# EAGLE schematic Lafferty1ab (EAGLE 6.6.0), part 2 of 2
## Sheet 5 of 5
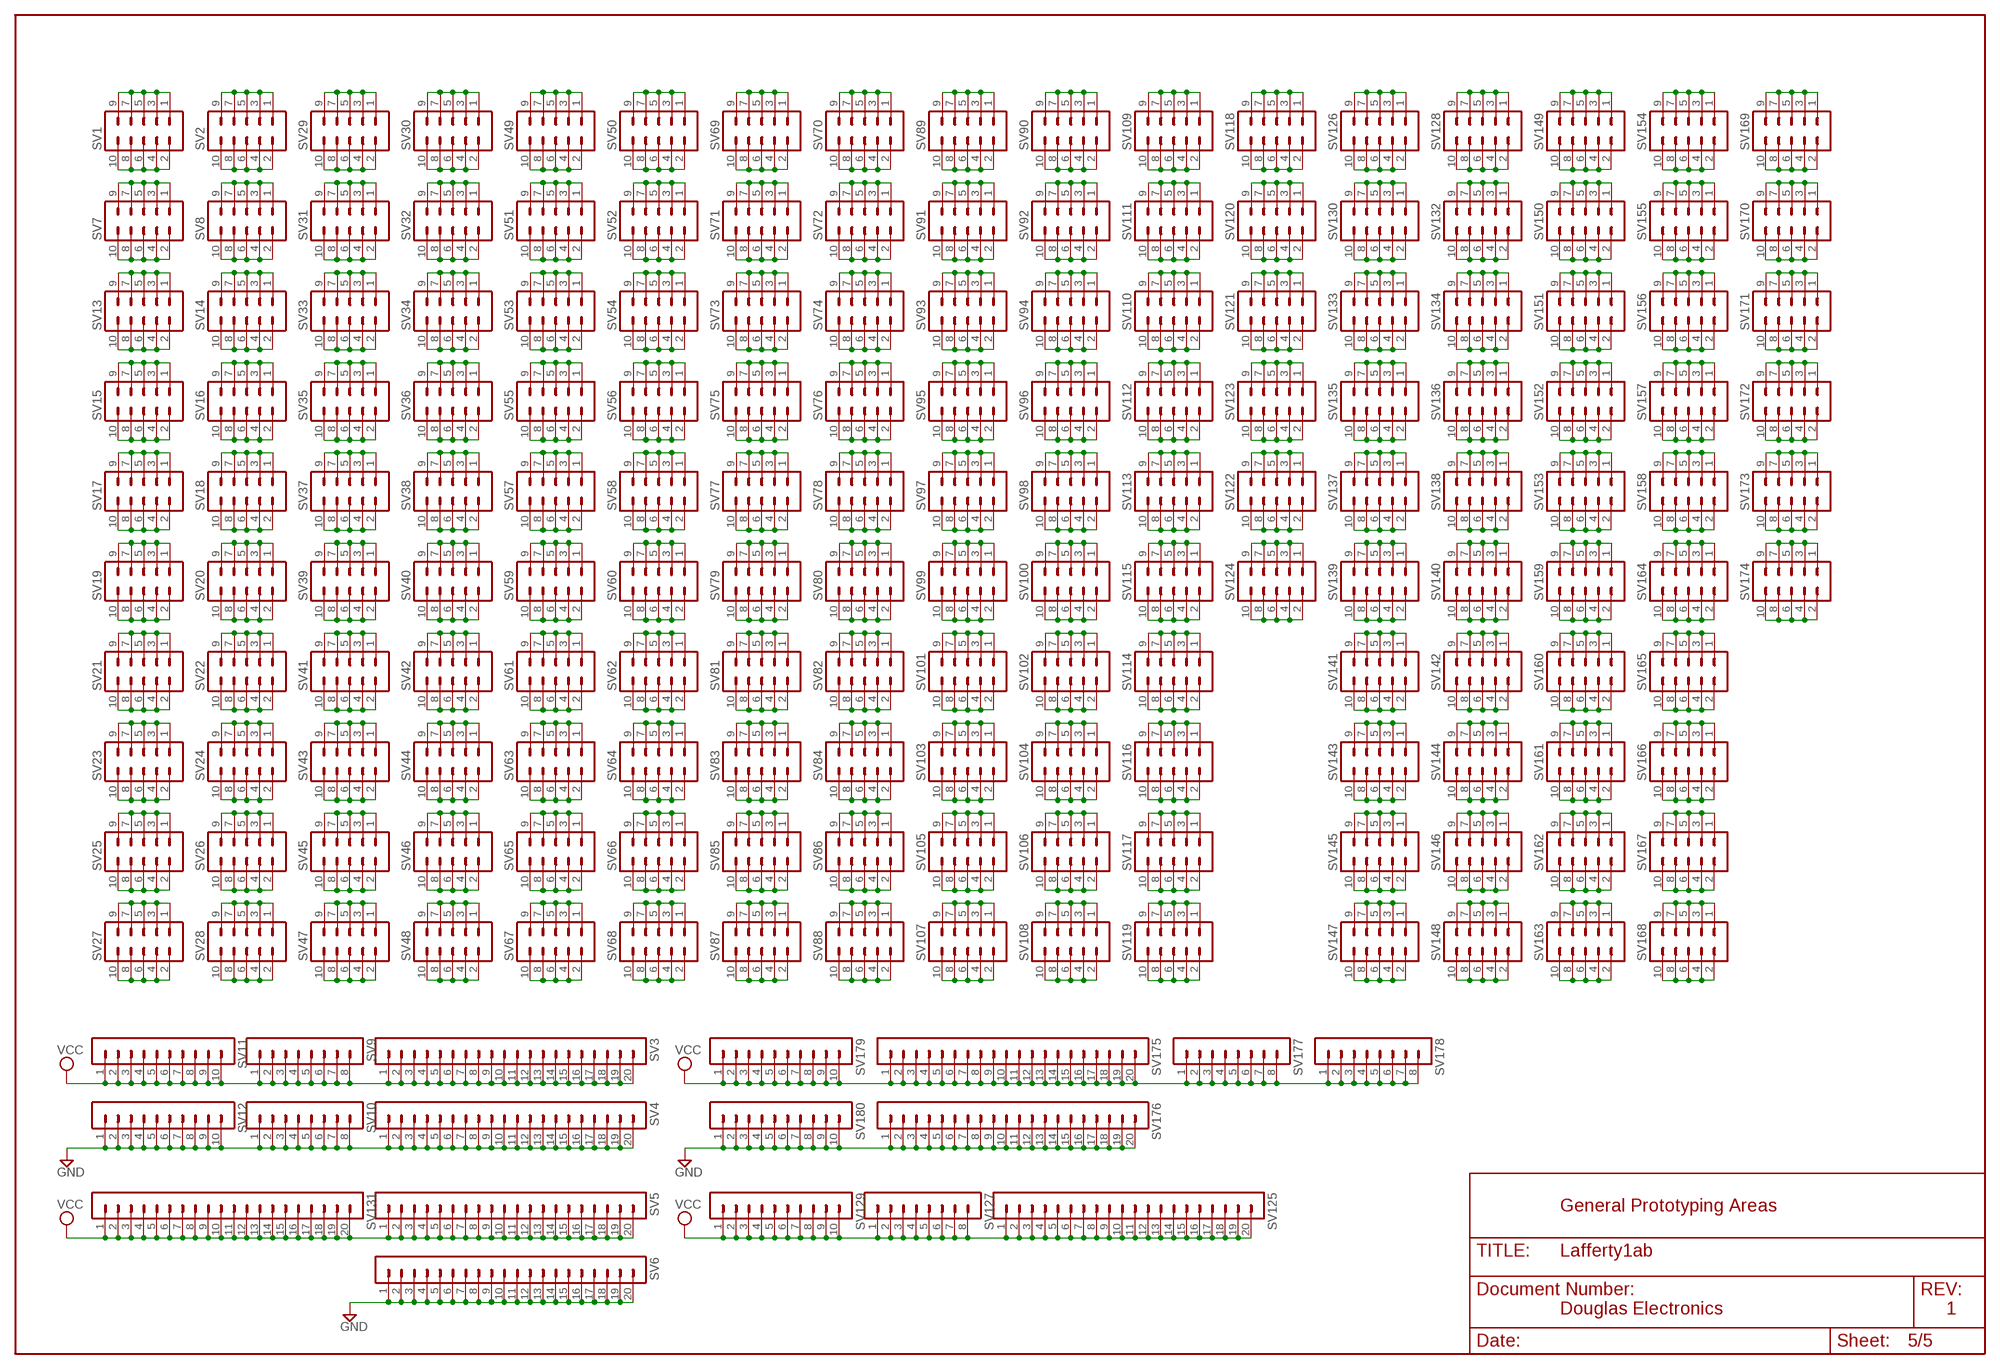
[diagram p4: schematic, sheet 5]

### Parts
SV1  MA05-2  [MA05-2]
SV2  MA05-2  [MA05-2]
SV3  MA20-1  [MA20-1]
SV4  MA20-1  [MA20-1]
SV5  MA20-1  [MA20-1]
SV6  MA20-1  [MA20-1]
SV7  MA05-2  [MA05-2]
SV8  MA05-2  [MA05-2]
SV9  MA08-1  [MA08-1]
SV10  MA08-1  [MA08-1]
SV11  MA10-1  [MA10-1]
SV12  MA10-1  [MA10-1]
SV13  MA05-2  [MA05-2]
SV14  MA05-2  [MA05-2]
SV15  MA05-2  [MA05-2]
SV16  MA05-2  [MA05-2]
SV17  MA05-2  [MA05-2]
SV18  MA05-2  [MA05-2]
SV19  MA05-2  [MA05-2]
SV20  MA05-2  [MA05-2]
SV21  MA05-2  [MA05-2]
SV22  MA05-2  [MA05-2]
SV23  MA05-2  [MA05-2]
SV24  MA05-2  [MA05-2]
SV25  MA05-2  [MA05-2]
SV26  MA05-2  [MA05-2]
SV27  MA05-2  [MA05-2]
SV28  MA05-2  [MA05-2]
SV29  MA05-2  [MA05-2]
SV30  MA05-2  [MA05-2]
SV31  MA05-2  [MA05-2]
SV32  MA05-2  [MA05-2]
SV33  MA05-2  [MA05-2]
SV34  MA05-2  [MA05-2]
SV35  MA05-2  [MA05-2]
SV36  MA05-2  [MA05-2]
SV37  MA05-2  [MA05-2]
SV38  MA05-2  [MA05-2]
SV39  MA05-2  [MA05-2]
SV40  MA05-2  [MA05-2]
SV41  MA05-2  [MA05-2]
SV42  MA05-2  [MA05-2]
SV43  MA05-2  [MA05-2]
SV44  MA05-2  [MA05-2]
SV45  MA05-2  [MA05-2]
SV46  MA05-2  [MA05-2]
SV47  MA05-2  [MA05-2]
SV48  MA05-2  [MA05-2]
SV49  MA05-2  [MA05-2]
SV50  MA05-2  [MA05-2]
SV51  MA05-2  [MA05-2]
SV52  MA05-2  [MA05-2]
SV53  MA05-2  [MA05-2]
SV54  MA05-2  [MA05-2]
SV55  MA05-2  [MA05-2]
SV56  MA05-2  [MA05-2]
SV57  MA05-2  [MA05-2]
SV58  MA05-2  [MA05-2]
SV59  MA05-2  [MA05-2]
SV60  MA05-2  [MA05-2]
SV61  MA05-2  [MA05-2]
SV62  MA05-2  [MA05-2]
SV63  MA05-2  [MA05-2]
SV64  MA05-2  [MA05-2]
SV65  MA05-2  [MA05-2]
SV66  MA05-2  [MA05-2]
SV67  MA05-2  [MA05-2]
SV68  MA05-2  [MA05-2]
SV69  MA05-2  [MA05-2]
SV70  MA05-2  [MA05-2]
SV71  MA05-2  [MA05-2]
SV72  MA05-2  [MA05-2]
SV73  MA05-2  [MA05-2]
SV74  MA05-2  [MA05-2]
SV75  MA05-2  [MA05-2]
SV76  MA05-2  [MA05-2]
SV77  MA05-2  [MA05-2]
SV78  MA05-2  [MA05-2]
SV79  MA05-2  [MA05-2]
SV80  MA05-2  [MA05-2]
SV81  MA05-2  [MA05-2]
SV82  MA05-2  [MA05-2]
SV83  MA05-2  [MA05-2]
SV84  MA05-2  [MA05-2]
SV85  MA05-2  [MA05-2]
SV86  MA05-2  [MA05-2]
SV87  MA05-2  [MA05-2]
SV88  MA05-2  [MA05-2]
SV89  MA05-2  [MA05-2]
SV90  MA05-2  [MA05-2]
SV91  MA05-2  [MA05-2]
SV92  MA05-2  [MA05-2]
SV93  MA05-2  [MA05-2]
SV94  MA05-2  [MA05-2]
SV95  MA05-2  [MA05-2]
SV96  MA05-2  [MA05-2]
SV97  MA05-2  [MA05-2]
SV98  MA05-2  [MA05-2]
SV99  MA05-2  [MA05-2]
SV100  MA05-2  [MA05-2]
SV101  MA05-2  [MA05-2]
SV102  MA05-2  [MA05-2]
SV103  MA05-2  [MA05-2]
SV104  MA05-2  [MA05-2]
SV105  MA05-2  [MA05-2]
SV106  MA05-2  [MA05-2]
SV107  MA05-2  [MA05-2]
SV108  MA05-2  [MA05-2]
SV109  MA05-2  [MA05-2]
SV110  MA05-2  [MA05-2]
SV111  MA05-2  [MA05-2]
SV112  MA05-2  [MA05-2]
SV113  MA05-2  [MA05-2]
SV114  MA05-2  [MA05-2]
SV115  MA05-2  [MA05-2]
SV116  MA05-2  [MA05-2]
SV117  MA05-2  [MA05-2]
SV118  MA05-2  [MA05-2]
SV119  MA05-2  [MA05-2]
SV120  MA05-2  [MA05-2]
SV121  MA05-2  [MA05-2]
SV122  MA05-2  [MA05-2]
SV123  MA05-2  [MA05-2]
SV124  MA05-2  [MA05-2]
SV125  MA20-1  [MA20-1]
SV126  MA05-2  [MA05-2]
SV127  MA08-1  [MA08-1]
SV128  MA05-2  [MA05-2]
SV129  MA10-1  [MA10-1]
SV130  MA05-2  [MA05-2]
SV131  MA20-1  [MA20-1]
SV132  MA05-2  [MA05-2]
SV133  MA05-2  [MA05-2]
SV134  MA05-2  [MA05-2]
SV135  MA05-2  [MA05-2]
SV136  MA05-2  [MA05-2]
SV137  MA05-2  [MA05-2]
SV138  MA05-2  [MA05-2]
SV139  MA05-2  [MA05-2]
SV140  MA05-2  [MA05-2]
SV141  MA05-2  [MA05-2]
SV142  MA05-2  [MA05-2]
SV143  MA05-2  [MA05-2]
SV144  MA05-2  [MA05-2]
SV145  MA05-2  [MA05-2]
SV146  MA05-2  [MA05-2]
SV147  MA05-2  [MA05-2]
SV148  MA05-2  [MA05-2]
SV149  MA05-2  [MA05-2]
SV150  MA05-2  [MA05-2]
SV151  MA05-2  [MA05-2]
SV152  MA05-2  [MA05-2]
SV153  MA05-2  [MA05-2]
SV154  MA05-2  [MA05-2]
SV155  MA05-2  [MA05-2]
SV156  MA05-2  [MA05-2]
SV157  MA05-2  [MA05-2]
SV158  MA05-2  [MA05-2]
SV159  MA05-2  [MA05-2]
SV160  MA05-2  [MA05-2]
SV161  MA05-2  [MA05-2]
SV162  MA05-2  [MA05-2]
SV163  MA05-2  [MA05-2]
SV164  MA05-2  [MA05-2]
SV165  MA05-2  [MA05-2]
SV166  MA05-2  [MA05-2]
SV167  MA05-2  [MA05-2]
SV168  MA05-2  [MA05-2]
SV169  MA05-2  [MA05-2]
SV170  MA05-2  [MA05-2]
SV171  MA05-2  [MA05-2]
SV172  MA05-2  [MA05-2]
SV173  MA05-2  [MA05-2]
SV174  MA05-2  [MA05-2]
SV175  MA20-1  [MA20-1]
SV176  MA20-1  [MA20-1]
SV177  MA08-1  [MA08-1]
SV178  MA08-1  [MA08-1]
SV179  MA10-1  [MA10-1]
SV180  MA10-1  [MA10-1]

### Nets
GND [supply]: SV4.1 SV4.2 SV4.3 SV4.4 SV4.5 SV4.6 SV4.7 SV4.8 SV4.9 SV4.10 SV4.11 SV4.12 SV4.13 SV4.14 SV4.15 SV4.16 SV4.17 SV4.18 SV4.19 SV4.20 SV6.1 SV6.2 SV6.3 SV6.4 SV6.5 SV6.6 SV6.7 SV6.8 SV6.9 SV6.10 SV6.11 SV6.12 SV6.13 SV6.14 SV6.15 SV6.16 SV6.17 SV6.18 SV6.19 SV6.20 SV10.1 SV10.2 SV10.3 SV10.4 SV10.5 SV10.6 SV10.7 SV10.8 SV12.1 SV12.2 SV12.3 SV12.4 SV12.5 SV12.6 SV12.7 SV12.8 SV12.9 SV12.10 SV176.1 SV176.2 SV176.3 SV176.4 SV176.5 SV176.6 SV176.7 SV176.8 SV176.9 SV176.10 SV176.11 SV176.12 SV176.13 SV176.14 SV176.15 SV176.16 SV176.17 SV176.18 SV176.19 SV176.20 SV180.1 SV180.2 SV180.3 SV180.4 SV180.5 SV180.6 SV180.7 SV180.8 SV180.9 SV180.10 ; also sheet 1,2,3,4
N$247: SV1.1 SV1.3 SV1.5 SV1.7 SV1.9
N$248: SV1.2 SV1.4 SV1.6 SV1.8 SV1.10
N$249: SV7.1 SV7.3 SV7.5 SV7.7 SV7.9
N$250: SV2.1 SV2.3 SV2.5 SV2.7 SV2.9
N$251: SV2.2 SV2.4 SV2.6 SV2.8 SV2.10
N$252: SV7.2 SV7.4 SV7.6 SV7.8 SV7.10
N$253: SV8.1 SV8.3 SV8.5 SV8.7 SV8.9
N$254: SV8.2 SV8.4 SV8.6 SV8.8 SV8.10
N$255: SV13.1 SV13.3 SV13.5 SV13.7 SV13.9
N$256: SV13.2 SV13.4 SV13.6 SV13.8 SV13.10
N$257: SV14.1 SV14.3 SV14.5 SV14.7 SV14.9
N$258: SV14.2 SV14.4 SV14.6 SV14.8 SV14.10
N$259: SV15.1 SV15.3 SV15.5 SV15.7 SV15.9
N$260: SV15.2 SV15.4 SV15.6 SV15.8 SV15.10
N$261: SV16.1 SV16.3 SV16.5 SV16.7 SV16.9
N$262: SV16.2 SV16.4 SV16.6 SV16.8 SV16.10
N$263: SV17.1 SV17.3 SV17.5 SV17.7 SV17.9
N$264: SV17.2 SV17.4 SV17.6 SV17.8 SV17.10
N$265: SV18.1 SV18.3 SV18.5 SV18.7 SV18.9
N$266: SV18.2 SV18.4 SV18.6 SV18.8 SV18.10
N$267: SV19.1 SV19.3 SV19.5 SV19.7 SV19.9
N$268: SV19.2 SV19.4 SV19.6 SV19.8 SV19.10
N$269: SV20.1 SV20.3 SV20.5 SV20.7 SV20.9
N$270: SV20.2 SV20.4 SV20.6 SV20.8 SV20.10
N$271: SV21.1 SV21.3 SV21.5 SV21.7 SV21.9
N$272: SV21.2 SV21.4 SV21.6 SV21.8 SV21.10
N$273: SV22.1 SV22.3 SV22.5 SV22.7 SV22.9
N$274: SV22.2 SV22.4 SV22.6 SV22.8 SV22.10
N$275: SV23.1 SV23.3 SV23.5 SV23.7 SV23.9
N$276: SV23.2 SV23.4 SV23.6 SV23.8 SV23.10
N$277: SV24.1 SV24.3 SV24.5 SV24.7 SV24.9
N$278: SV24.2 SV24.4 SV24.6 SV24.8 SV24.10
N$279: SV25.1 SV25.3 SV25.5 SV25.7 SV25.9
N$280: SV25.2 SV25.4 SV25.6 SV25.8 SV25.10
N$281: SV26.1 SV26.3 SV26.5 SV26.7 SV26.9
N$282: SV26.2 SV26.4 SV26.6 SV26.8 SV26.10
N$283: SV27.1 SV27.3 SV27.5 SV27.7 SV27.9
N$284: SV27.2 SV27.4 SV27.6 SV27.8 SV27.10
N$285: SV28.1 SV28.3 SV28.5 SV28.7 SV28.9
N$286: SV28.2 SV28.4 SV28.6 SV28.8 SV28.10
N$287: SV29.1 SV29.3 SV29.5 SV29.7 SV29.9
N$288: SV29.2 SV29.4 SV29.6 SV29.8 SV29.10
N$289: SV30.1 SV30.3 SV30.5 SV30.7 SV30.9
N$290: SV30.2 SV30.4 SV30.6 SV30.8 SV30.10
N$291: SV31.1 SV31.3 SV31.5 SV31.7 SV31.9
N$292: SV31.2 SV31.4 SV31.6 SV31.8 SV31.10
N$293: SV32.1 SV32.3 SV32.5 SV32.7 SV32.9
N$294: SV32.2 SV32.4 SV32.6 SV32.8 SV32.10
N$295: SV33.1 SV33.3 SV33.5 SV33.7 SV33.9
N$296: SV33.2 SV33.4 SV33.6 SV33.8 SV33.10
N$297: SV34.1 SV34.3 SV34.5 SV34.7 SV34.9
N$298: SV34.2 SV34.4 SV34.6 SV34.8 SV34.10
N$299: SV35.1 SV35.3 SV35.5 SV35.7 SV35.9
N$300: SV35.2 SV35.4 SV35.6 SV35.8 SV35.10
N$301: SV36.1 SV36.3 SV36.5 SV36.7 SV36.9
N$302: SV36.2 SV36.4 SV36.6 SV36.8 SV36.10
N$303: SV37.1 SV37.3 SV37.5 SV37.7 SV37.9
N$304: SV37.2 SV37.4 SV37.6 SV37.8 SV37.10
N$305: SV38.1 SV38.3 SV38.5 SV38.7 SV38.9
N$306: SV38.2 SV38.4 SV38.6 SV38.8 SV38.10
N$307: SV39.1 SV39.3 SV39.5 SV39.7 SV39.9
N$308: SV39.2 SV39.4 SV39.6 SV39.8 SV39.10
N$309: SV40.1 SV40.3 SV40.5 SV40.7 SV40.9
N$310: SV40.2 SV40.4 SV40.6 SV40.8 SV40.10
N$311: SV41.1 SV41.3 SV41.5 SV41.7 SV41.9
N$312: SV41.2 SV41.4 SV41.6 SV41.8 SV41.10
N$313: SV42.1 SV42.3 SV42.5 SV42.7 SV42.9
N$314: SV42.2 SV42.4 SV42.6 SV42.8 SV42.10
N$315: SV43.1 SV43.3 SV43.5 SV43.7 SV43.9
N$316: SV43.2 SV43.4 SV43.6 SV43.8 SV43.10
N$317: SV44.1 SV44.3 SV44.5 SV44.7 SV44.9
N$318: SV44.2 SV44.4 SV44.6 SV44.8 SV44.10
N$319: SV45.1 SV45.3 SV45.5 SV45.7 SV45.9
N$320: SV45.2 SV45.4 SV45.6 SV45.8 SV45.10
N$321: SV46.1 SV46.3 SV46.5 SV46.7 SV46.9
N$322: SV46.2 SV46.4 SV46.6 SV46.8 SV46.10
N$323: SV47.1 SV47.3 SV47.5 SV47.7 SV47.9
N$324: SV47.2 SV47.4 SV47.6 SV47.8 SV47.10
N$325: SV48.1 SV48.3 SV48.5 SV48.7 SV48.9
N$326: SV48.2 SV48.4 SV48.6 SV48.8 SV48.10
N$327: SV49.1 SV49.3 SV49.5 SV49.7 SV49.9
N$328: SV49.2 SV49.4 SV49.6 SV49.8 SV49.10
N$329: SV50.1 SV50.3 SV50.5 SV50.7 SV50.9
N$330: SV50.2 SV50.4 SV50.6 SV50.8 SV50.10
N$331: SV51.1 SV51.3 SV51.5 SV51.7 SV51.9
N$332: SV51.2 SV51.4 SV51.6 SV51.8 SV51.10
N$333: SV52.1 SV52.3 SV52.5 SV52.7 SV52.9
N$334: SV52.2 SV52.4 SV52.6 SV52.8 SV52.10
N$335: SV53.1 SV53.3 SV53.5 SV53.7 SV53.9
N$336: SV53.2 SV53.4 SV53.6 SV53.8 SV53.10
N$337: SV54.1 SV54.3 SV54.5 SV54.7 SV54.9
N$338: SV54.2 SV54.4 SV54.6 SV54.8 SV54.10
N$339: SV55.1 SV55.3 SV55.5 SV55.7 SV55.9
N$340: SV55.2 SV55.4 SV55.6 SV55.8 SV55.10
N$341: SV56.1 SV56.3 SV56.5 SV56.7 SV56.9
N$342: SV56.2 SV56.4 SV56.6 SV56.8 SV56.10
N$343: SV57.1 SV57.3 SV57.5 SV57.7 SV57.9
N$344: SV57.2 SV57.4 SV57.6 SV57.8 SV57.10
N$345: SV58.1 SV58.3 SV58.5 SV58.7 SV58.9
N$346: SV58.2 SV58.4 SV58.6 SV58.8 SV58.10
N$347: SV59.1 SV59.3 SV59.5 SV59.7 SV59.9
N$348: SV59.2 SV59.4 SV59.6 SV59.8 SV59.10
N$349: SV60.1 SV60.3 SV60.5 SV60.7 SV60.9
N$350: SV60.2 SV60.4 SV60.6 SV60.8 SV60.10
N$351: SV61.1 SV61.3 SV61.5 SV61.7 SV61.9
N$352: SV61.2 SV61.4 SV61.6 SV61.8 SV61.10
N$353: SV62.1 SV62.3 SV62.5 SV62.7 SV62.9
N$354: SV62.2 SV62.4 SV62.6 SV62.8 SV62.10
N$355: SV63.1 SV63.3 SV63.5 SV63.7 SV63.9
N$356: SV63.2 SV63.4 SV63.6 SV63.8 SV63.10
N$357: SV64.1 SV64.3 SV64.5 SV64.7 SV64.9
N$358: SV64.2 SV64.4 SV64.6 SV64.8 SV64.10
N$359: SV65.1 SV65.3 SV65.5 SV65.7 SV65.9
N$360: SV65.2 SV65.4 SV65.6 SV65.8 SV65.10
N$361: SV66.1 SV66.3 SV66.5 SV66.7 SV66.9
N$362: SV66.2 SV66.4 SV66.6 SV66.8 SV66.10
N$363: SV67.1 SV67.3 SV67.5 SV67.7 SV67.9
N$364: SV67.2 SV67.4 SV67.6 SV67.8 SV67.10
N$365: SV68.1 SV68.3 SV68.5 SV68.7 SV68.9
N$366: SV68.2 SV68.4 SV68.6 SV68.8 SV68.10
N$367: SV69.1 SV69.3 SV69.5 SV69.7 SV69.9
N$368: SV69.2 SV69.4 SV69.6 SV69.8 SV69.10
N$369: SV70.1 SV70.3 SV70.5 SV70.7 SV70.9
N$370: SV70.2 SV70.4 SV70.6 SV70.8 SV70.10
N$371: SV71.1 SV71.3 SV71.5 SV71.7 SV71.9
N$372: SV71.2 SV71.4 SV71.6 SV71.8 SV71.10
N$373: SV72.1 SV72.3 SV72.5 SV72.7 SV72.9
N$374: SV72.2 SV72.4 SV72.6 SV72.8 SV72.10
N$375: SV73.1 SV73.3 SV73.5 SV73.7 SV73.9
N$376: SV73.2 SV73.4 SV73.6 SV73.8 SV73.10
N$377: SV74.1 SV74.3 SV74.5 SV74.7 SV74.9
N$378: SV74.2 SV74.4 SV74.6 SV74.8 SV74.10
N$379: SV75.1 SV75.3 SV75.5 SV75.7 SV75.9
N$380: SV75.2 SV75.4 SV75.6 SV75.8 SV75.10
N$381: SV76.1 SV76.3 SV76.5 SV76.7 SV76.9
N$382: SV76.2 SV76.4 SV76.6 SV76.8 SV76.10
N$383: SV77.1 SV77.3 SV77.5 SV77.7 SV77.9
N$384: SV77.2 SV77.4 SV77.6 SV77.8 SV77.10
N$385: SV78.1 SV78.3 SV78.5 SV78.7 SV78.9
N$386: SV78.2 SV78.4 SV78.6 SV78.8 SV78.10
N$387: SV79.1 SV79.3 SV79.5 SV79.7 SV79.9
N$388: SV79.2 SV79.4 SV79.6 SV79.8 SV79.10
N$389: SV80.1 SV80.3 SV80.5 SV80.7 SV80.9
N$390: SV80.2 SV80.4 SV80.6 SV80.8 SV80.10
N$391: SV81.1 SV81.3 SV81.5 SV81.7 SV81.9
N$392: SV81.2 SV81.4 SV81.6 SV81.8 SV81.10
N$393: SV82.1 SV82.3 SV82.5 SV82.7 SV82.9
N$394: SV82.2 SV82.4 SV82.6 SV82.8 SV82.10
N$395: SV83.1 SV83.3 SV83.5 SV83.7 SV83.9
N$396: SV83.2 SV83.4 SV83.6 SV83.8 SV83.10
N$397: SV84.1 SV84.3 SV84.5 SV84.7 SV84.9
N$398: SV84.2 SV84.4 SV84.6 SV84.8 SV84.10
N$399: SV85.1 SV85.3 SV85.5 SV85.7 SV85.9
N$400: SV85.2 SV85.4 SV85.6 SV85.8 SV85.10
N$401: SV86.1 SV86.3 SV86.5 SV86.7 SV86.9
N$402: SV86.2 SV86.4 SV86.6 SV86.8 SV86.10
N$403: SV87.1 SV87.3 SV87.5 SV87.7 SV87.9
N$404: SV87.2 SV87.4 SV87.6 SV87.8 SV87.10
N$405: SV88.1 SV88.3 SV88.5 SV88.7 SV88.9
N$406: SV88.2 SV88.4 SV88.6 SV88.8 SV88.10
N$407: SV89.1 SV89.3 SV89.5 SV89.7 SV89.9
N$408: SV89.2 SV89.4 SV89.6 SV89.8 SV89.10
N$409: SV90.1 SV90.3 SV90.5 SV90.7 SV90.9
N$410: SV90.2 SV90.4 SV90.6 SV90.8 SV90.10
N$411: SV91.1 SV91.3 SV91.5 SV91.7 SV91.9
N$412: SV91.2 SV91.4 SV91.6 SV91.8 SV91.10
N$413: SV92.1 SV92.3 SV92.5 SV92.7 SV92.9
N$414: SV92.2 SV92.4 SV92.6 SV92.8 SV92.10
N$415: SV93.1 SV93.3 SV93.5 SV93.7 SV93.9
N$416: SV93.2 SV93.4 SV93.6 SV93.8 SV93.10
N$417: SV94.1 SV94.3 SV94.5 SV94.7 SV94.9
N$418: SV94.2 SV94.4 SV94.6 SV94.8 SV94.10
N$419: SV95.1 SV95.3 SV95.5 SV95.7 SV95.9
N$420: SV95.2 SV95.4 SV95.6 SV95.8 SV95.10
N$421: SV96.1 SV96.3 SV96.5 SV96.7 SV96.9
N$422: SV96.2 SV96.4 SV96.6 SV96.8 SV96.10
N$423: SV97.1 SV97.3 SV97.5 SV97.7 SV97.9
N$424: SV97.2 SV97.4 SV97.6 SV97.8 SV97.10
N$425: SV98.1 SV98.3 SV98.5 SV98.7 SV98.9
N$426: SV98.2 SV98.4 SV98.6 SV98.8 SV98.10
N$427: SV99.1 SV99.3 SV99.5 SV99.7 SV99.9
N$428: SV99.2 SV99.4 SV99.6 SV99.8 SV99.10
N$429: SV100.1 SV100.3 SV100.5 SV100.7 SV100.9
N$430: SV100.2 SV100.4 SV100.6 SV100.8 SV100.10
N$431: SV101.1 SV101.3 SV101.5 SV101.7 SV101.9
N$432: SV101.2 SV101.4 SV101.6 SV101.8 SV101.10
N$433: SV102.1 SV102.3 SV102.5 SV102.7 SV102.9
N$434: SV102.2 SV102.4 SV102.6 SV102.8 SV102.10
N$435: SV103.1 SV103.3 SV103.5 SV103.7 SV103.9
N$436: SV103.2 SV103.4 SV103.6 SV103.8 SV103.10
N$437: SV104.1 SV104.3 SV104.5 SV104.7 SV104.9
N$438: SV104.2 SV104.4 SV104.6 SV104.8 SV104.10
N$439: SV105.1 SV105.3 SV105.5 SV105.7 SV105.9
N$440: SV105.2 SV105.4 SV105.6 SV105.8 SV105.10
N$441: SV106.1 SV106.3 SV106.5 SV106.7 SV106.9
N$442: SV106.2 SV106.4 SV106.6 SV106.8 SV106.10
N$443: SV107.1 SV107.3 SV107.5 SV107.7 SV107.9
N$444: SV107.2 SV107.4 SV107.6 SV107.8 SV107.10
N$445: SV108.1 SV108.3 SV108.5 SV108.7 SV108.9
N$446: SV108.2 SV108.4 SV108.6 SV108.8 SV108.10
N$447: SV109.1 SV109.3 SV109.5 SV109.7 SV109.9
N$448: SV109.2 SV109.4 SV109.6 SV109.8 SV109.10
N$449: SV110.1 SV110.3 SV110.5 SV110.7 SV110.9
N$450: SV110.2 SV110.4 SV110.6 SV110.8 SV110.10
N$451: SV111.1 SV111.3 SV111.5 SV111.7 SV111.9
N$452: SV111.2 SV111.4 SV111.6 SV111.8 SV111.10
N$453: SV112.1 SV112.3 SV112.5 SV112.7 SV112.9
N$454: SV112.2 SV112.4 SV112.6 SV112.8 SV112.10
N$455: SV113.1 SV113.3 SV113.5 SV113.7 SV113.9
N$456: SV113.2 SV113.4 SV113.6 SV113.8 SV113.10
N$457: SV114.1 SV114.3 SV114.5 SV114.7 SV114.9
N$458: SV114.2 SV114.4 SV114.6 SV114.8 SV114.10
N$459: SV115.1 SV115.3 SV115.5 SV115.7 SV115.9
N$460: SV115.2 SV115.4 SV115.6 SV115.8 SV115.10
N$461: SV116.1 SV116.3 SV116.5 SV116.7 SV116.9
N$462: SV116.2 SV116.4 SV116.6 SV116.8 SV116.10
N$463: SV117.1 SV117.3 SV117.5 SV117.7 SV117.9
N$464: SV117.2 SV117.4 SV117.6 SV117.8 SV117.10
N$465: SV118.1 SV118.3 SV118.5 SV118.7 SV118.9
N$466: SV118.2 SV118.4 SV118.6 SV118.8 SV118.10
N$467: SV119.1 SV119.3 SV119.5 SV119.7 SV119.9
N$468: SV119.2 SV119.4 SV119.6 SV119.8 SV119.10
N$469: SV120.1 SV120.3 SV120.5 SV120.7 SV120.9
N$470: SV120.2 SV120.4 SV120.6 SV120.8 SV120.10
N$471: SV121.1 SV121.3 SV121.5 SV121.7 SV121.9
N$472: SV121.2 SV121.4 SV121.6 SV121.8 SV121.10
N$473: SV122.1 SV122.3 SV122.5 SV122.7 SV122.9
N$474: SV122.2 SV122.4 SV122.6 SV122.8 SV122.10
N$475: SV123.1 SV123.3 SV123.5 SV123.7 SV123.9
N$476: SV123.2 SV123.4 SV123.6 SV123.8 SV123.10
N$477: SV124.1 SV124.3 SV124.5 SV124.7 SV124.9
N$478: SV124.2 SV124.4 SV124.6 SV124.8 SV124.10
N$655: SV126.1 SV126.3 SV126.5 SV126.7 SV126.9
N$656: SV126.2 SV126.4 SV126.6 SV126.8 SV126.10
N$657: SV128.1 SV128.3 SV128.5 SV128.7 SV128.9
N$658: SV128.2 SV128.4 SV128.6 SV128.8 SV128.10
N$659: SV130.1 SV130.3 SV130.5 SV130.7 SV130.9
N$660: SV130.2 SV130.4 SV130.6 SV130.8 SV130.10
N$661: SV132.1 SV132.3 SV132.5 SV132.7 SV132.9
N$662: SV132.2 SV132.4 SV132.6 SV132.8 SV132.10
N$663: SV133.1 SV133.3 SV133.5 SV133.7 SV133.9
N$664: SV133.2 SV133.4 SV133.6 SV133.8 SV133.10
N$665: SV134.1 SV134.3 SV134.5 SV134.7 SV134.9
N$666: SV134.2 SV134.4 SV134.6 SV134.8 SV134.10
N$667: SV135.1 SV135.3 SV135.5 SV135.7 SV135.9
N$668: SV135.2 SV135.4 SV135.6 SV135.8 SV135.10
N$669: SV136.1 SV136.3 SV136.5 SV136.7 SV136.9
N$670: SV136.2 SV136.4 SV136.6 SV136.8 SV136.10
N$671: SV137.1 SV137.3 SV137.5 SV137.7 SV137.9
N$672: SV137.2 SV137.4 SV137.6 SV137.8 SV137.10
N$673: SV138.1 SV138.3 SV138.5 SV138.7 SV138.9
N$674: SV138.2 SV138.4 SV138.6 SV138.8 SV138.10
N$675: SV139.1 SV139.3 SV139.5 SV139.7 SV139.9
N$676: SV139.2 SV139.4 SV139.6 SV139.8 SV139.10
N$677: SV140.1 SV140.3 SV140.5 SV140.7 SV140.9
N$678: SV140.2 SV140.4 SV140.6 SV140.8 SV140.10
N$679: SV141.1 SV141.3 SV141.5 SV141.7 SV141.9
N$680: SV141.2 SV141.4 SV141.6 SV141.8 SV141.10
N$681: SV142.1 SV142.3 SV142.5 SV142.7 SV142.9
N$682: SV142.2 SV142.4 SV142.6 SV142.8 SV142.10
N$683: SV143.1 SV143.3 SV143.5 SV143.7 SV143.9
N$684: SV143.2 SV143.4 SV143.6 SV143.8 SV143.10
N$685: SV144.1 SV144.3 SV144.5 SV144.7 SV144.9
N$686: SV144.2 SV144.4 SV144.6 SV144.8 SV144.10
N$687: SV145.1 SV145.3 SV145.5 SV145.7 SV145.9
N$688: SV145.2 SV145.4 SV145.6 SV145.8 SV145.10
N$689: SV146.1 SV146.3 SV146.5 SV146.7 SV146.9
N$690: SV146.2 SV146.4 SV146.6 SV146.8 SV146.10
N$691: SV147.1 SV147.3 SV147.5 SV147.7 SV147.9
N$692: SV147.2 SV147.4 SV147.6 SV147.8 SV147.10
N$693: SV148.1 SV148.3 SV148.5 SV148.7 SV148.9
N$694: SV148.2 SV148.4 SV148.6 SV148.8 SV148.10
N$695: SV149.1 SV149.3 SV149.5 SV149.7 SV149.9
N$696: SV149.2 SV149.4 SV149.6 SV149.8 SV149.10
N$697: SV150.1 SV150.3 SV150.5 SV150.7 SV150.9
N$698: SV150.2 SV150.4 SV150.6 SV150.8 SV150.10
N$699: SV151.1 SV151.3 SV151.5 SV151.7 SV151.9
N$700: SV151.2 SV151.4 SV151.6 SV151.8 SV151.10
N$701: SV152.1 SV152.3 SV152.5 SV152.7 SV152.9
N$702: SV152.2 SV152.4 SV152.6 SV152.8 SV152.10
N$703: SV153.1 SV153.3 SV153.5 SV153.7 SV153.9
N$704: SV153.2 SV153.4 SV153.6 SV153.8 SV153.10
N$705: SV154.1 SV154.3 SV154.5 SV154.7 SV154.9
N$706: SV154.2 SV154.4 SV154.6 SV154.8 SV154.10
N$707: SV155.1 SV155.3 SV155.5 SV155.7 SV155.9
N$708: SV155.2 SV155.4 SV155.6 SV155.8 SV155.10
N$709: SV156.1 SV156.3 SV156.5 SV156.7 SV156.9
N$710: SV156.2 SV156.4 SV156.6 SV156.8 SV156.10
N$711: SV157.1 SV157.3 SV157.5 SV157.7 SV157.9
N$712: SV157.2 SV157.4 SV157.6 SV157.8 SV157.10
N$713: SV158.1 SV158.3 SV158.5 SV158.7 SV158.9
N$714: SV158.2 SV158.4 SV158.6 SV158.8 SV158.10
N$779: SV159.1 SV159.3 SV159.5 SV159.7 SV159.9
N$780: SV159.2 SV159.4 SV159.6 SV159.8 SV159.10
N$781: SV160.1 SV160.3 SV160.5 SV160.7 SV160.9
N$782: SV160.2 SV160.4 SV160.6 SV160.8 SV160.10
N$783: SV161.1 SV161.3 SV161.5 SV161.7 SV161.9
N$784: SV161.2 SV161.4 SV161.6 SV161.8 SV161.10
N$785: SV162.1 SV162.3 SV162.5 SV162.7 SV162.9
N$786: SV162.2 SV162.4 SV162.6 SV162.8 SV162.10
N$787: SV163.1 SV163.3 SV163.5 SV163.7 SV163.9
N$788: SV163.2 SV163.4 SV163.6 SV163.8 SV163.10
N$789: SV164.1 SV164.3 SV164.5 SV164.7 SV164.9
N$790: SV164.2 SV164.4 SV164.6 SV164.8 SV164.10
N$791: SV165.1 SV165.3 SV165.5 SV165.7 SV165.9
N$792: SV165.2 SV165.4 SV165.6 SV165.8 SV165.10
N$793: SV166.1 SV166.3 SV166.5 SV166.7 SV166.9
N$794: SV166.2 SV166.4 SV166.6 SV166.8 SV166.10
N$795: SV167.1 SV167.3 SV167.5 SV167.7 SV167.9
N$796: SV167.2 SV167.4 SV167.6 SV167.8 SV167.10
N$797: SV168.1 SV168.3 SV168.5 SV168.7 SV168.9
N$798: SV168.2 SV168.4 SV168.6 SV168.8 SV168.10
N$799: SV169.1 SV169.3 SV169.5 SV169.7 SV169.9
N$800: SV169.2 SV169.4 SV169.6 SV169.8 SV169.10
N$801: SV170.1 SV170.3 SV170.5 SV170.7 SV170.9
N$802: SV170.2 SV170.4 SV170.6 SV170.8 SV170.10
N$803: SV171.1 SV171.3 SV171.5 SV171.7 SV171.9
N$804: SV171.2 SV171.4 SV171.6 SV171.8 SV171.10
N$805: SV172.1 SV172.3 SV172.5 SV172.7 SV172.9
N$806: SV172.2 SV172.4 SV172.6 SV172.8 SV172.10
N$807: SV173.1 SV173.3 SV173.5 SV173.7 SV173.9
N$808: SV173.2 SV173.4 SV173.6 SV173.8 SV173.10
N$809: SV174.1 SV174.3 SV174.5 SV174.7 SV174.9
N$810: SV174.2 SV174.4 SV174.6 SV174.8 SV174.10
VCC [supply]: SV3.1 SV3.2 SV3.3 SV3.4 SV3.5 SV3.6 SV3.7 SV3.8 SV3.9 SV3.10 SV3.11 SV3.12 SV3.13 SV3.14 SV3.15 SV3.16 SV3.17 SV3.18 SV3.19 SV3.20 SV5.1 SV5.2 SV5.3 SV5.4 SV5.5 SV5.6 SV5.7 SV5.8 SV5.9 SV5.10 SV5.11 SV5.12 SV5.13 SV5.14 SV5.15 SV5.16 SV5.17 SV5.18 SV5.19 SV5.20 SV9.1 SV9.2 SV9.3 SV9.4 SV9.5 SV9.6 SV9.7 SV9.8 SV11.1 SV11.2 SV11.3 SV11.4 SV11.5 SV11.6 SV11.7 SV11.8 SV11.9 SV11.10 SV125.1 SV125.2 SV125.3 SV125.4 SV125.5 SV125.6 SV125.7 SV125.8 SV125.9 SV125.10 SV125.11 SV125.12 SV125.13 SV125.14 SV125.15 SV125.16 SV125.17 SV125.18 SV125.19 SV125.20 SV127.1 SV127.2 SV127.3 SV127.4 SV127.5 SV127.6 SV127.7 SV127.8 SV129.1 SV129.2 SV129.3 SV129.4 SV129.5 SV129.6 SV129.7 SV129.8 SV129.9 SV129.10 SV131.1 SV131.2 SV131.3 SV131.4 SV131.5 SV131.6 SV131.7 SV131.8 SV131.9 SV131.10 SV131.11 SV131.12 SV131.13 SV131.14 SV131.15 SV131.16 SV131.17 SV131.18 SV131.19 SV131.20 SV175.1 SV175.2 SV175.3 SV175.4 SV175.5 SV175.6 SV175.7 SV175.8 SV175.9 SV175.10 SV175.11 SV175.12 SV175.13 SV175.14 SV175.15 SV175.16 SV175.17 SV175.18 SV175.19 SV175.20 SV177.1 SV177.2 SV177.3 SV177.4 SV177.5 SV177.6 SV177.7 SV177.8 SV178.1 SV178.2 SV178.3 SV178.4 SV178.5 SV178.6 SV178.7 SV178.8 SV179.1 SV179.2 SV179.3 SV179.4 SV179.5 SV179.6 SV179.7 SV179.8 SV179.9 SV179.10 ; also sheet 1,2,4

### Notes on the sheet
- General Prototyping Areas
- Douglas Electronics | 1

## Power pins joined to a net without a drawn wire
GND: IC1.10(GND) IC2.10(GND) IC5.8(GND) IC6.7(GND) IC7.7(P:GND) IC8.10(GND)
VCC: IC1.20(VCC) IC2.20(VCC) IC5.16(VCC) IC6.14(VCC) IC7.14(P:VCC) IC8.20(VCC)

## Library data of the parts
A1-A448 GND1-GND44 VCC1-VCC44 = jumper:JP1E: JUMPER
B1 = battery:B2430UNI: LI BATTERY
C1-C9 = rcl:C-US: CAPACITOR, American symbol
C10 = dec-con:CPOL-USE20-8AXIAL: A 0.8 inch electrolytic.
D1 D2 = diode:BAT19: DIODE barrier diode
D7-D14 = dec-con:MA18-1
IC1 IC2 = 74xx-us:74*245: Octal BUS TRANSCEIVER, 3-state
IC3 IC4 = memory-hitachi:58C256P: MEMORY
IC5 = 74xx-us:74*138: 3-line to 8-line DECODER/DEMULTIPLEXER
IC6 = 74xx-us:74*30: 8-input NAND gate
IC7 = 74xx-us:74*20: Dual 4-input NAND gate
IC8 = 74xx-us:74*540: Octal BUFFER and LINE DRIVER, 3-state
IC9-IC36 = ic-package:DIL16: Dual In Line
Q1 = transistor:2N3904: NPN TRANSISTOR
R1-R4 R6 R7 = rcl:R-US_: RESISTOR, American symbol
R5 = resistor-dil:8R-P: DIL RESISTOR
S1 = special:SW_DIP-8: DIP SWITCH
SV1 SV2 SV7 SV8 SV13-SV124 SV126 SV128 SV130 SV132-SV174 = con-lstb:MA05-2: PIN HEADER
SV3-SV6 SV125 SV131 SV175 SV176 = con-lstb:MA20-1: PIN HEADER
SV9 SV10 SV127 SV177 SV178 = con-lstb:MA08-1: PIN HEADER
SV11 SV12 SV129 SV179 SV180 = con-lstb:MA10-1: PIN HEADER
U$1 = dec-con:OUTLINE-*: Board outlines for DEC boards.
U$2 = dec-con:QUAD: Quad-Height DEC board

## Net classes
1 supply: width 0.813 mm